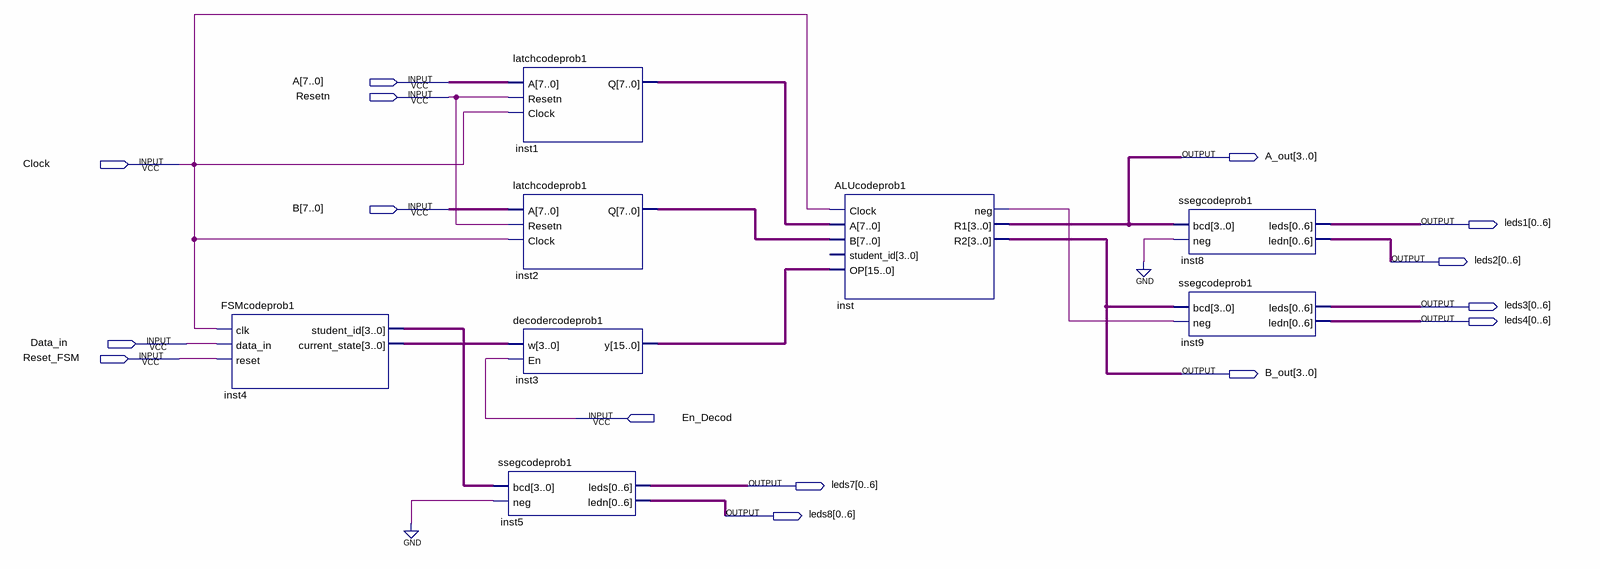
[diagram p0: schematic sheet]
// Quartus schematic aluschemprob1final.bdf as structural Verilog: 8 symbols, 15 pins
module aluschemprob1final (
  input  [7:0] A,
  input  Resetn,
  input  Clock,
  input  [7:0] B,
  input  Data_in,
  input  Reset_FSM,
  input  En_Decod,
  output [3:0] A_out,
  output [0:6] leds1,
  output [0:6] leds2,
  output [0:6] leds3,
  output [0:6] leds4,
  output [3:0] B_out,
  output [0:6] leds7,
  output [0:6] leds8
);

  wire inst_neg;
  wire [3:0] inst4_current_state, inst4_student_id;
  wire [7:0] inst1_q, inst2_q;
  wire [15:0] inst3_y;

  FSMcodeprob1 inst4 (
    .clk(Clock), .data_in(Data_in), .reset(Reset_FSM), .student_id(inst4_student_id),
    .current_state(inst4_current_state));
  latchcodeprob1 inst1 (.A(A), .Resetn(Resetn), .Clock(Clock), .Q(inst1_q));
  latchcodeprob1 inst2 (.A(B), .Resetn(Resetn), .Clock(Clock), .Q(inst2_q));
  decodercodeprob1 inst3 (.w(inst4_current_state), .En(En_Decod), .y(inst3_y));
  ssegcodeprob1 inst5 (.bcd(inst4_student_id), .neg(1'b0), .leds(leds7), .ledn(leds8));
  ALUcodeprob1 inst (
    .Clock(Clock), .A(inst1_q), .B(inst2_q), .OP(inst3_y), .neg(inst_neg), .R1(A_out), .R2(B_out));  // open: student_id
  ssegcodeprob1 inst8 (.bcd(A_out), .neg(1'b0), .leds(leds1), .ledn(leds2));
  ssegcodeprob1 inst9 (.bcd(B_out), .neg(inst_neg), .leds(leds3), .ledn(leds4));
endmodule
